# Altium project 28Pins_Project_V1I1.PrjPcb
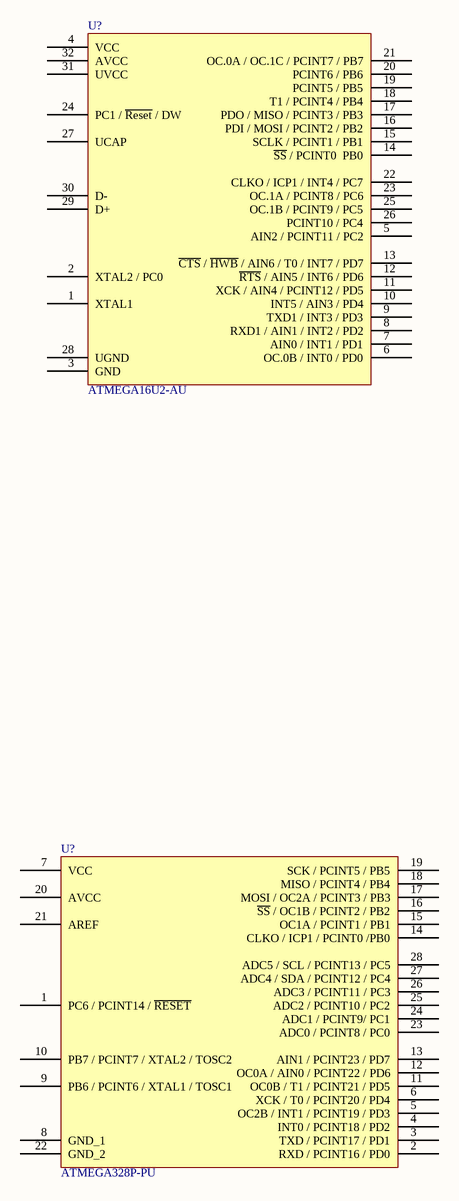
[diagram p0: 28Pins_Schematic.SchDoc]
1 sheet, 2 parts. Net scope: global (net labels, ports and power ports of the same name join across sheets).
Board file: 28Pins_Project_V1I1_PCB.PcbDoc

## Sheet 28Pins_Schematic.SchDoc
size A2

### Parts
(Parts that share a designator on the sheet are numbered #1, #2 ... from top to bottom, then left to right.)
U?#1  ATMEGA16U2-AU  [TQFP32]
U?#2  ATMEGA328P-PU  [28_DIP_7.62mm]

### Nets

Not connected (* = marked no-connect by the designer): U?#1 1(XTAL1) 2(XTAL2_/_PC0) 3(GND) 4(VCC) 5(AIN2_/_PCINT11_/_PC2) 6(OC.0B_/_INT0_/_PD0) 7(AIN0_/_INT1_/_PD1) 8(RXD1_/_AIN1_/_INT2_/_PD2) 9(TXD1_/_INT3_/_PD3) 10(INT5_/_AIN3_/_PD4) 11(XCK_/_AIN4_/_PCINT12_/_PD5) 12(~{RTS}_/_AIN5_/_INT6_/_PD6) 13(~{CTS}_/_~{HWB}_/_AIN6_/_T0_/_INT7_/_PD7) 14(~{SS}_/_PCINT0__PB0) 15(SCLK_/_PCINT1_/_PB1) 16(PDI_/_MOSI_/_PCINT2_/_PB2) 17(PDO_/_MISO_/_PCINT3_/_PB3) 18(T1_/_PCINT4_/_PB4) 19(PCINT5_/_PB5) 20(PCINT6_/_PB6) 21(OC.0A_/_OC.1C_/_PCINT7_/_PB7) 22(CLKO_/_ICP1_/_INT4_/_PC7) 23(OC.1A_/_PCINT8_/_PC6) 24(PC1_/_~{Reset}_/_DW) 25(OC.1B_/_PCINT9_/_PC5) 26(PCINT10_/_PC4) 27(UCAP) 28(UGND) 29(D+) 30(D-) 31(UVCC) 32(AVCC); U?#2 1(PC6_/_PCINT14_/_~{RESET}) 2(RXD_/_PCINT16_/_PD0) 3(TXD_/_PCINT17_/_PD1) 4(INT0_/_PCINT18_/_PD2) 5(OC2B_/_INT1_/_PCINT19_/_PD3) 6(XCK_/_T0_/_PCINT20_/_PD4) 7(VCC) 8(GND_1) 9(PB6_/_PCINT6_/_XTAL1_/_TOSC1) 10(PB7_/_PCINT7_/_XTAL2_/_TOSC2) 11(OC0B_/_T1_/_PCINT21_/_PD5) 12(OC0A_/_AIN0_/_PCINT22_/_PD6) 13(AIN1_/_PCINT23_/_PD7) 14(CLKO_/_ICP1_/_PCINT0_/PB0) 15(OC1A_/_PCINT1_/_PB1) 16(~{SS}_/_OC1B_/_PCINT2_/_PB2) 17(MOSI_/_OC2A_/_PCINT3_/_PB3) 18(MISO_/_PCINT4_/_PB4) 19(SCK_/_PCINT5_/_PB5) 20(AVCC) 21(AREF) 22(GND_2) 23(ADC0_/_PCINT8_/_PC0) 24(ADC1_/_PCINT9/_PC1) 25(ADC2_/_PCINT10_/_PC2) 26(ADC3_/_PCINT11_/_PC3) 27(ADC4_/_SDA_/_PCINT12_/_PC4) 28(ADC5_/_SCL_/_PCINT13_/_PC5)

### Library data of the parts
U?#1 = ATMEGA16U2-AU: ATMEL         ATMEGA16U2-AU            MCU, 8BIT, MEGAAVR, 16MHZ, TQFP-32; Manufacturer: Microchip / Atmel; MCU Applications: USB Microcontroller; Program Memory Size: 16KB; RAM Memory Size: 512Byte; No. of I/O's: 22I/O's; MCU Case Style: TQFP; No. of Pins: 32Pins; Embedded Interface Type: QSPI, UART, USB; Supply Voltage Min: 2.7V; Supply Voltage Max: 5.5V; SVHC: No SVHC (15-Jun-2015); Supplier 1: Digi-Key; Manufacturer Part Number: ATMEGA16U2-AU; Stock 1: 1480; Pricing 1: 1=2.52, 25=2.3176, 100=2.1012 (USD); Architecture: megaAVR; MCU Core Size: 8bit; CPU Speed: 16MHz; Packaging: Each; MSL: MSL 3 - 168 hours; ComponentLink1URL: https://datasheet.ciiva.com/13036/doc7799-28769-13036800.pdf; ComponentLink1Description: https://datasheet.ciiva.com/13036/doc7799-28769-13036800.pdf; ComponentLink2URL: https://datasheet.ciiva.com/22651/doc7799-22651110.pdf; ComponentLink2Description: https://datasheet.ciiva.com/22651/doc7799-22651110.pdf; Supplier Part Number 1: ATMEGA16U2-AU-ND
U?#2 = ATMEGA328P-PU: Manufacturer: Microchip; Supplier 1: Digi-Key; Manufacturer Part Number: ATMEGA328P-PU; Stock 1: 6787; Pricing 1: 1=2.14, 25=1.9672, 100=1.7819 (USD); ComponentLink1URL: http://www.farnell.com/datasheets/2295887.pdf; ComponentLink1Description: http://www.farnell.com/datasheets/2295887.pdf; ComponentLink2URL: http://www.microchip.com/mymicrochip/filehandler.aspx?ddocname=en589968; ComponentLink2Description: http://www.microchip.com/mymicrochip/filehandler.aspx?ddocname=en589968; Supplier Part Number 1: ATMEGA328P-PU-ND